# Altium schematic sheet Servo Bus Controller.SchDoc
size A; SheetNumber: 1; SheetTotal: 3
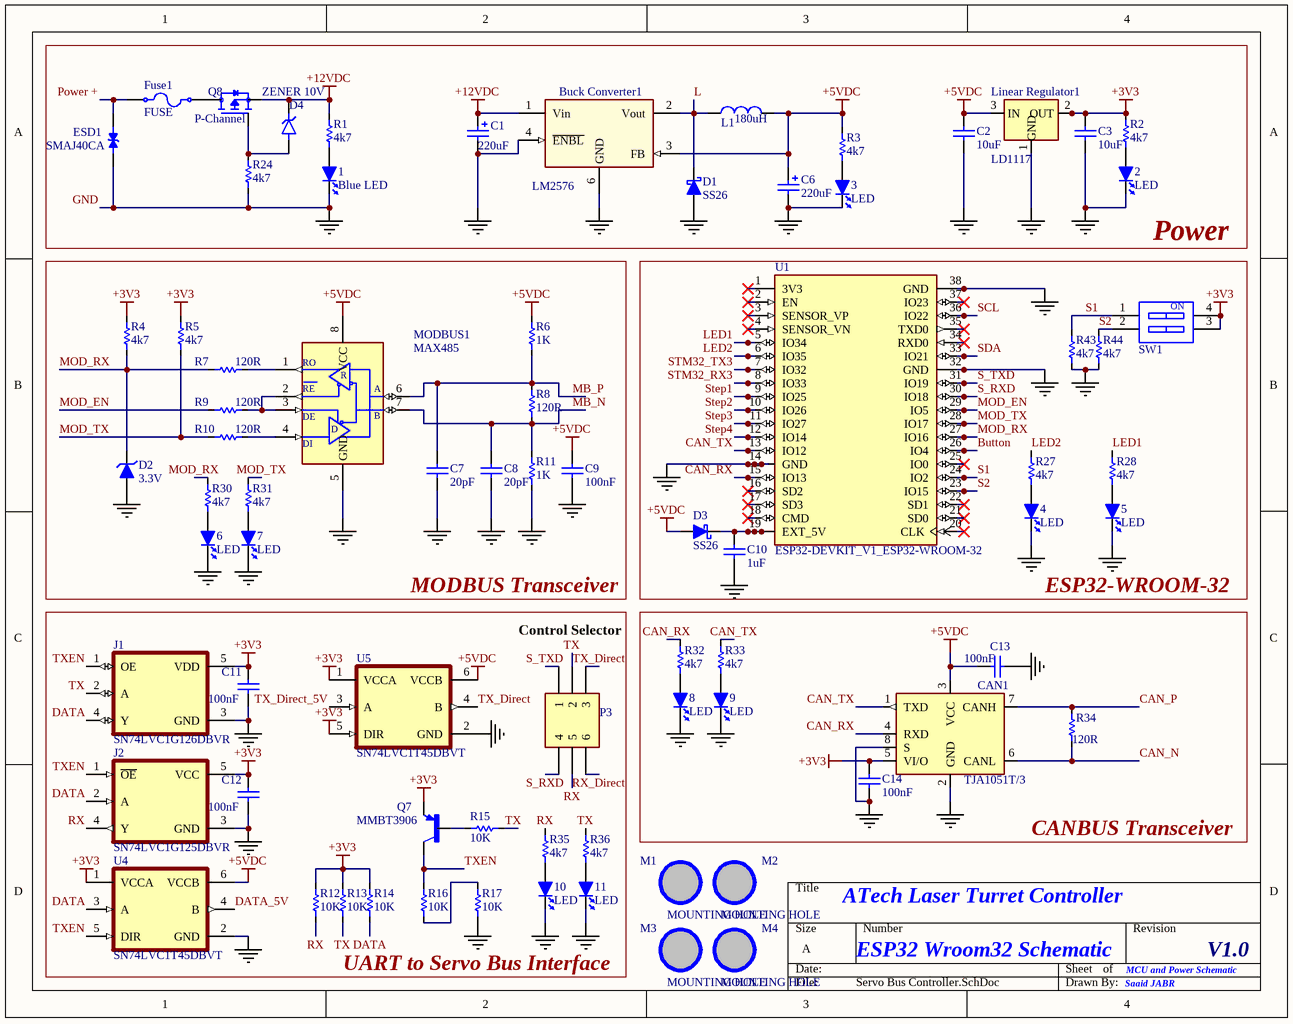
[diagram p0: Servo Bus Controller.SchDoc]

## Parts
1  Blue LED  [LED1206]
2  LED  [LED1206]
3  LED  [LED1206]
4  LED  [LED1206]
5  LED  [LED1206]
6  LED  [LED1206]
7  LED  [LED1206]
8  LED  [LED1206]
9  LED  [LED1206]
10  LED  [LED1206]
11  LED  [LED1206]
Buck_Converter1  LM2576  [TO-263BA]
C1  220uF  [CAP AL-EL H12MM D8MM P3.5MM]
C2  10uF  [CC3216-1206L]
C3  10uF  [CC3216-1206L]
C6  220uF  [CAP AL-EL H12MM D8MM P3.5MM]
C7  20pF  [CC3216-1206L]
C8  20pF  [CC3216-1206L]
C9  100nF  [CC3216-1206L]
C10  1uF  [CC3216-1206L]
C11  100nF  [CC3216-1206L]
C12  100nF  [CC3216-1206L]
C13  100nF  [CC3216-1206L]
C14  100nF  [CC3216-1206L]
CAN1  TJA1051T/3  [SOT96-1]
D1  SS26  [SMB]
D2  3.3V  [SOD123]
D3  SS26  [SMB]
D4  ZENER 10V  [DIOAD1036W73L450D282]
ESD1  SMAJ40CA  [DIOM4325X250N]
Fuse1  FUSE  [FUSE 5x20]
J1  SN74LVC1G126DBVR  [SOT95P280X145-5N]
J2  SN74LVC1G125DBVR  [SOT95P280X145-5N]
L1  180uH  [FPI1005]
Linear_Regulator1  LD1117  [SOT230P700X180-4N]
M1  MOUNTING HOLE  [MOUNTING HOLE ROUND NONPLATED 3MM PLASTIC]  (no BOM)
M2  MOUNTING HOLE  [MOUNTING HOLE ROUND NONPLATED 3MM PLASTIC]  (no BOM)
M3  MOUNTING HOLE  [MOUNTING HOLE ROUND NONPLATED 3MM PLASTIC]  (no BOM)
M4  MOUNTING HOLE  [MOUNTING HOLE ROUND NONPLATED 3MM PLASTIC]  (no BOM)
MODBUS1  MAX485  [SOIC127P600X175-8N]
P3  CONNECTOR, 1x3, 3P  [HDR_MALE_2X3_6P_2.54MM_180]  (value not drawn)
Q7  MMBT3906  [SOT95P260X140-3N]
Q8  P-Channel  [TO254P1052X465X1989-3]
R1  4k7  [CR3216-1206l]
R2  4k7  [CR3216-1206l]
R3  4k7  [CR3216-1206l]
R4  4k7  [CR3216-1206l]
R5  4k7  [CR3216-1206l]
R6  1K  [CR3216-1206l]
R7  120R  [CR3216-1206l]
R8  120R  [CR3216-1206l]
R9  120R  [CR3216-1206l]
R10  120R  [CR3216-1206l]
R11  1K  [CR3216-1206l]
R12  10K  [CR3216-1206l]
R13  10K  [CR3216-1206l]
R14  10K  [CR3216-1206l]
R15  10K  [CR3216-1206l]
R16  10K  [CR3216-1206l]
R17  10K  [CR3216-1206l]
R24  4k7  [CR3216-1206l]
R27  4k7  [CR3216-1206l]
R28  4k7  [CR3216-1206l]
R30  4k7  [CR3216-1206l]
R31  4k7  [CR3216-1206l]
R32  4k7  [CR3216-1206l]
R33  4k7  [CR3216-1206l]
R34  120R  [CR3216-1206l]
R35  4k7  [CR3216-1206l]
R36  4k7  [CR3216-1206l]
R43  4k7  [CR3216-1206l]
R44  4k7  [CR3216-1206l]
SW1  DIP Switch  [418117170902]  (value not drawn)
U1  ESP32-DEVKIT_V1_ESP32-WROOM-32  [MODULE_DEVKIT_V1_ESP32-WROOM-32]
U4  SN74LVC1T45DBVT  [SOT95P280X145-6N]
U5  SN74LVC1T45DBVT  [SOT95P280X145-6N]

## Blocks framed on the sheet
MODBUS Transceiver: 6 7 C7-C9 D2 MODBUS1 R4-R11 R30 R31
Power: 4 5 C10 D3 R27 R28 R43 R44 SW1 U1
UART to Servo Bus Interface: 10 11 C11 C12 J1 J2 P3 Q7 R12-R17 R35 R36 U4 U5

## Nets
3V3: U1.39(3V3)
+3V3: C3.1 C11.1 C12.1 C14.1 CAN1.5(VI/O) J1.5(VDD) J2.5(VCC) Linear_Regulator1.2(OUT) Linear_Regulator1.4(OUT) Q7.2(E) R2.2 R4.2 R5.2 R12.2 R13.2 R14.2 SW1.3 SW1.4 U4.1(VCCA) U5.1(VCCA) U5.5(DIR)
+5VDC: Buck_Converter1.3(FB) C2.1 C6.1 C9.1 C13.2 CAN1.3(VCC) D3.1 L1.2 Linear_Regulator1.3(IN) MODBUS1.8(VCC) R3.2 R6.1 U4.6(VCCB) U5.6(VCCB)
+12VDC: Buck_Converter1.1(Vin) C1.1 D4.C(K) Q8.3(S) R1.2
CLK: U1.76(CLK)
CMD: U1.56(CMD)
EN: U1.40(EN)
EXT_5V: U1.57(EXT_5V)
GND: 1.2(CATHODE) 2.2(CATHODE) 3.2(CATHODE) 4.2(CATHODE) 5.2(CATHODE) 6.2(CATHODE) 7.2(CATHODE) 8.2(CATHODE) 9.2(CATHODE) 10.2(CATHODE) 11.2(CATHODE) Buck_Converter1.4(~{ENBL}) Buck_Converter1.6(GND) C1.2 C2.2 C3.2 C6.2 C7.2 C8.2 C9.2 C10.2 C11.2 C12.2 C13.1 C14.2 CAN1.2(GND) CAN1.8(S) D1.1 D2.1 ESD1.1 J1.3(GND) J2.3(GND) Linear_Regulator1.1(GND) MODBUS1.5(GND) R11.2 R17.2 R24.2 R43.1 R44.1 U1.14(GND) U1.32(GND) U1.38(GND) U1.52(GND) U1.58(GND) U1.64(GND) U1.102(GND) U1.103(GND) U4.2(GND) U5.2(GND)
IO0: U1.71(IO0)
IO2: U1.72(IO2)
IO4: U1.70(IO4)
IO5: U1.67(IO5)
IO12: U1.51(IO12)
IO13: U1.53(IO13)
IO14: U1.50(IO14)
IO15: U1.73(IO15)
IO16: U1.69(IO16)
IO17: U1.68(IO17)
IO18: U1.66(IO18)
IO19: U1.65(IO19)
IO21: U1.63(IO21)
IO22: U1.60(IO22)
IO23: U1.59(IO23)
IO25: U1.47(IO25)
IO26: U1.48(IO26)
IO27: U1.49(IO27)
IO32: U1.45(IO32)
IO33: U1.46(IO33)
IO34: U1.43(IO34)
IO35: U1.44(IO35)
RXD0: U1.62(RXD0)
SD0: U1.75(SD0)
SD1: U1.74(SD1)
SD2: U1.54(SD2)
SD3: U1.55(SD3)
SENSOR_VN: U1.42(SENSOR_VN)
SENSOR_VP: U1.41(SENSOR_VP)
TXD0: U1.61(TXD0)
Button: U1.26(IO4) U1.70(IO4)
CAN_N: CAN1.6(CANL) R34.1
CAN_P: CAN1.7(CANH) R34.2
CAN_RX: CAN1.4(RXD) R32.2 U1.15(IO13) U1.53(IO13)
CAN_TX: CAN1.1(TXD) R33.2 U1.13(IO12) U1.51(IO12)
DATA: J1.4(Y) J2.2(A) R14.1 U4.3(A)
DATA_5V: U4.4(B)
L: Buck_Converter1.2(Vout) D1.2 L1.1
LED1: R28.2 U1.5(IO34) U1.43(IO34)
LED2: R27.2 U1.6(IO35) U1.44(IO35)
MB_N: C8.1 MODBUS1.7(B) R8.2 R11.1
MB_P: C7.1 MODBUS1.6(A) R6.2 R8.1
MOD_EN: R9.2 U1.29(IO5) U1.67(IO5)
MOD_RX: D2.2 R4.1 R7.2 R30.2 U1.27(IO16) U1.69(IO16)
MOD_TX: R5.1 R10.2 R31.2 U1.28(IO17) U1.68(IO17)
Power +: ESD1.2 Fuse1.1
RX: J2.4(Y) P3.5 R12.1 R35.2
RX_Direct: P3.6
S1: R43.2 SW1.1 U1.24(IO2) U1.72(IO2)
S2: R44.2 SW1.2 U1.23(IO15) U1.73(IO15)
S_RXD: P3.4 U1.30(IO18) U1.66(IO18)
S_TXD: P3.1 U1.31(IO19) U1.65(IO19)
SCL: U1.36(IO22) U1.60(IO22)
SDA: U1.33(IO21) U1.63(IO21)
Step1: U1.9(IO25) U1.47(IO25)
Step2: U1.10(IO26) U1.48(IO26)
Step3: U1.11(IO27) U1.49(IO27)
Step4: U1.12(IO14) U1.50(IO14)
STM32_RX3: U1.8(IO33) U1.46(IO33)
STM32_TX3: U1.7(IO32) U1.45(IO32)
TX: J1.2(A) P3.2 R13.1 R15.1 R36.2
TX_Direct: P3.3 U5.4(B)
TX_Direct_5V: U5.3(A)
TXEN: J1.1(OE) J2.1(~{OE}) Q7.3(C) R16.1 U4.5(DIR)
Net1_1: 1.1(ANODE) R1.1
Net2_1: 2.1(ANODE) R2.1
Net3_1: 3.1(ANODE) R3.1
Net4_1: 4.1(ANODE) R27.1
Net5_1: 5.1(ANODE) R28.1
Net6_1: 6.1(ANODE) R30.1
Net7_1: 7.1(ANODE) R31.1
Net8_1: 8.1(ANODE) R32.1
Net9_1: 9.1(ANODE) R33.1
Net10_1: 10.1(ANODE) R35.1
Net11_1: 11.1(ANODE) R36.1
NetC10_1: C10.1 D3.2 U1.19(EXT_5V) U1.57(EXT_5V) U1.101(EXT_5V) U1.104(EXT_5V)
NetD4_A: D4.A Q8.1(G) R24.1
NetFuse1_2: Fuse1.2 Q8.2(D)
NetMODBUS1_1: MODBUS1.1(RO) R7.1
NetMODBUS1_2: MODBUS1.2(~{RE}) MODBUS1.3(DE) R9.1
NetMODBUS1_4: MODBUS1.4(DI) R10.1
NetQ7_1: Q7.1(B) R15.2
NetR16_2: R16.2 R17.1
NetU1_1: U1.1(3V3) U1.39(3V3)
NetU1_2: U1.2(EN) U1.40(EN)
NetU1_3: U1.3(SENSOR_VP) U1.41(SENSOR_VP)
NetU1_4: U1.4(SENSOR_VN) U1.42(SENSOR_VN)
NetU1_16: U1.16(SD2) U1.54(SD2)
NetU1_17: U1.17(SD3) U1.55(SD3)
NetU1_18: U1.18(CMD) U1.56(CMD)
NetU1_20: U1.20(CLK) U1.76(CLK)
NetU1_21: U1.21(SD0) U1.75(SD0)
NetU1_22: U1.22(SD1) U1.74(SD1)
NetU1_25: U1.25(IO0) U1.71(IO0)
NetU1_34: U1.34(RXD0) U1.62(RXD0)
NetU1_35: U1.35(TXD0) U1.61(TXD0)
NetU1_37: U1.37(IO23) U1.59(IO23)

Not connected (* = marked no-connect by the designer): Buck_Converter1 5(NC) 7(NC) 8(NC)

## Notes on the sheet
- Control Selector
- ESP32-WROOM-32
- CANBUS Transceiver
- ATech Laser Turret Controller
- ESP32 Wroom32 Schematic
- MCU and Power Schematic
- V1.0
- Saaid JABR
- (in symbol DIP Switch 2) ON
- (in symbol MAX485) R; RE; D

## Library data of the parts
1 = LED: Ozdisan: HL-PSC-2012H203BC; Stock Code: *; Component Type: Diode; PriceUSD: 0.0007685
2-11 = LED: Ozdisan: HL-PC-3216U51GC; Stock Code: *; Component Type: Diode; PriceUSD: 0.0016
Buck_Converter1 = LM2576DP: 3A, 52kHz, Step-Down Switching Regulator; Ozdisan: *; PriceUSD: *
C1 C6 = CAPACITOR POL: Capacitor; Ozdisan: PKRM-025V221MF115-T/A5.0; Stock Code: *; Component Type: Capacitor; PriceUSD: 0.02312
C2 C3 C10 = CAPACITOR NON-POL: Capacitor; Ozdisan: CL31B106KAHNNNE; Stock Code: *; Component Type: Capacitor; PriceUSD: 0.006808
C7 C8 = CAPACITOR NON-POL: Capacitor; Ozdisan: CL31C220JBCNNNC; Stock Code: *; Component Type: Capacitor; PriceUSD: 0.006466
C9 C13 C14 = CAPACITOR NON-POL: Capacitor; Ozdisan: CL31B104KCFNNNE; Stock Code: *; Component Type: Capacitor; PriceUSD: 0.001135
C11 C12 = CAPACITOR NON-POL: Capacitor; Stock Code: *; Component Type: Capacitor
CAN1 = TJA1051T/3: 1/1 ÐŸÑ€Ð¸ÐµÐ¼Ð¾Ð¿ÐµÑ€ÐµÐ´Ð°Ñ‚Ñ‡Ð¸Ðº ÐŸÐ¾Ð»Ð¾Ð²Ð¸Ð½Ð° CANbus 8-SO; MF: NXP USA; Ozdisan: TJA1051T/3,118; Price: None; Availability: In Stock; Purchase-URL: https://pricing.snapeda.com/search/part/TJA1051T/3/?ref=eda; SnapEDA_Link: https://www.snapeda.com/parts/TJA1051T/3/NXP+USA+Inc./view-part/?ref=snap; MP: TJA1051T/3; Value: *; Check_prices: https://www.snapeda.com/parts/TJA1051T/3/NXP+USA+Inc./view-part/?ref=eda; Package: SO-8 NXP Semiconductors; PriceUSD: 0.61954
D1 D3 = DIODE SCHOTTKY: SINGLE SCHOTTKY DIODE / Check the suitability of the case with the pin number; Ozdisan: SS26-SMB-JQ; Stock Code: *; Component Type: Diode; PriceUSD: 0.006698
D2 = DIODE ZENER: Ozdisan: MMSZ3V3-HT; Component Type: Diode; Stock Code: *; PriceUSD: 0.001732
D4 = DIODE ZENER: DIODE BZX85C10 Zener Diode 10 V 1.3 W Â±5% Through Hole DO-204AL (DO-41); MF: Taiwan Semiconductor; SnapEDA_Link: https://www.snapeda.com/parts/BZX85C10/Taiwan+Semiconductor/view-part/?ref=snap; Package: DO-41-2 Taiwan Semiconductor; Value: *; MP: BZX85C10; Check_prices: https://www.snapeda.com/parts/BZX85C10/Taiwan+Semiconductor/view-part/?ref=eda
ESD1 = SMAJ40CA: MP: SMAJ40CA-HT; Price: None; Availability: Unavailable; Package: None; Value: *; Ozdisan: SMAJ40CA-HT; PriceUSD: 0.012908
Fuse1 = FUSE: Ozdisan: L-KLS5-2611; Component Type: Fuse; Stock Code: *; PriceUSD: 0.12995
J1 = SN74LVC1G126DBVR: Single 1.65-V to 5.5-V buffer with 3-state outputs; MF: Texas Instruments; SnapEDA_Link: https://www.snapeda.com/parts/SN74LVC1G126DBVR/Texas+Instruments/view-part/?ref=snap; Package: SOT-23-5 Texas Instruments; Value: *; MP: SN74LVC1G126DBVR; Check_prices: https://www.snapeda.com/parts/SN74LVC1G126DBVR/Texas+Instruments/view-part/?ref=eda
J2 = SN74LVC1G125DBVR: Single 1.65-V to 5.5-V buffer with 3-state outputs; MF: Texas Instruments; SnapEDA_Link: https://www.snapeda.com/parts/SN74LVC1G125DBVR/Texas+Instruments/view-part/?ref=snap; Package: SOT-23-5 Texas Instruments; Value: *; MP: SN74LVC1G125DBVR; Check_prices: https://www.snapeda.com/parts/SN74LVC1G125DBVR/Texas+Instruments/view-part/?ref=eda
L1 = INDUCTOR: Ozdisan: FP11005-181M; Stock Code: *; Component Type: Inductor; PriceUSD: 0.21045
Linear_Regulator1 = LM1117: Linear Voltage Regulators; Ozdisan: LD1117AS33TR; Component Type: IC; Stock Code: *; PriceUSD: 0.08667
MODBUS1 = MAX485: ROHS-ICMAX485CSA MAXIM; Ozdisan: SN65HVD485EDR; Stock Code: *; Component Type: IC; PriceUSD: 0.81157
P3 = CONNECTOR, 2x3, 3P: Component Type: Connector
Q7 = MMBT3906: Trans GP BJT PNP 40V 3-Pin SOT-23; MF: Rectron; SnapEDA_Link: https://www.snapeda.com/parts/MMBT3906/Rectron/view-part/?ref=snap; Package: None; Value: *; MP: MMBT3906; Check_prices: https://www.snapeda.com/parts/MMBT3906/Rectron/view-part/?ref=eda
Q8 = IRF9540: P-Channel 100 V 19A (Tc) 3.7W (Ta), 150W (Tc) Surface Mount DÂ²PAK (TO-263); MF: Vishay; SnapEDA_Link: https://www.snapeda.com/parts/IRF9540/Vishay+Siliconix/view-part/?ref=snap; Package: TO-220-3 Vishay; Value: *; MP: IRF9540; Check_prices: https://www.snapeda.com/parts/IRF9540/Vishay+Siliconix/view-part/?ref=eda
R1-R5 R24 R27 R28 R30-R33 R35 R36 R43 R44 = RESISTOR: Ozdisan: RC1206JR-074K7L; Component Type: Resistor; PriceUSD: 0.0000351
R6 R11 = RESISTOR: Ozdisan: 1206S4F1001T5E; Component Type: Resistor; PriceUSD: 0.0000312
R7-R10 R34 = RESISTOR: Ozdisan: RC1206JR-07120RL; Component Type: Resistor; PriceUSD: 0.0000351
R12-R17 = RESISTOR: Component Type: Resistor
SW1 = DIP Switch 2: WS-DITV Compact THT Dip Switch, Flat Actuator, pitch 2.54mm, 2p; Manufacturer: Wurth Elektronik; Actuator Type: Flat Type; Operation Force: 800g; Rated Current Non-Switching: 100mA; Rated Current Switching: 25mA; Rated Voltage Non-Switching: 50VDC; Rated Voltage Switching: 24VDC; Number of Poles: 2; ComponentLink1Description: Website Link; ComponentLink1URL: https://www.we-online.com/redexpert/article/418117170902?ad; ComponentLink2Description: Datasheet Link; ComponentLink2URL: https://www.we-online.com/redexpert/spec/418117170902?ad; Manufacturer Part Number: 418117170902; Category: Dip Switches; Match Code: WS-DITV; Mount: Through Hole; Operating Temperature Max: 85°C; Operating Temperature Min: -40°C; Packaging: Tube; Contact Material: Copper Alloy; Contact Plating: Gold; Pitch: 2.54mm
U1 = ESP32-DEVKIT_V1_ESP32-WROOM-32: WROOM-32 Development Board ESP32 ESP-32S WiFi Bluetooth Dev Module; MF: Espressif Systems; MP: DEVKIT V1 ESP32-WROOM-32; SnapEDA_Link: https://www.snapeda.com/parts/DEVKIT%20V1%20ESP32-WROOM-32/Espressif+Systems/view-part/?ref=snap; Package: Package; Value: *; Check_prices: https://www.snapeda.com/parts/DEVKIT%20V1%20ESP32-WROOM-32/Espressif+Systems/view-part/?ref=eda
U4 U5 = Level Shiftter: Single-Bit Dual-Supply Bus Transceiver with Configurable Voltage-Level Shifting and 3-State Outputs; MF: Texas Instruments; SnapEDA_Link: https://www.snapeda.com/parts/SN74LVC1T45DBVT/Texas+Instruments/view-part/?ref=snap; Package: SOT-23-6 Texas Instruments; Value: *; MP: SN74LVC1T45DBVT; Check_prices: https://www.snapeda.com/parts/SN74LVC1T45DBVT/Texas+Instruments/view-part/?ref=eda
M1-M4 = MOUNTING HOLE: Ozdisan: *; PriceUSD: *